# EAGLE design KonamiSCC_Replacement (EAGLE 7.5.0)
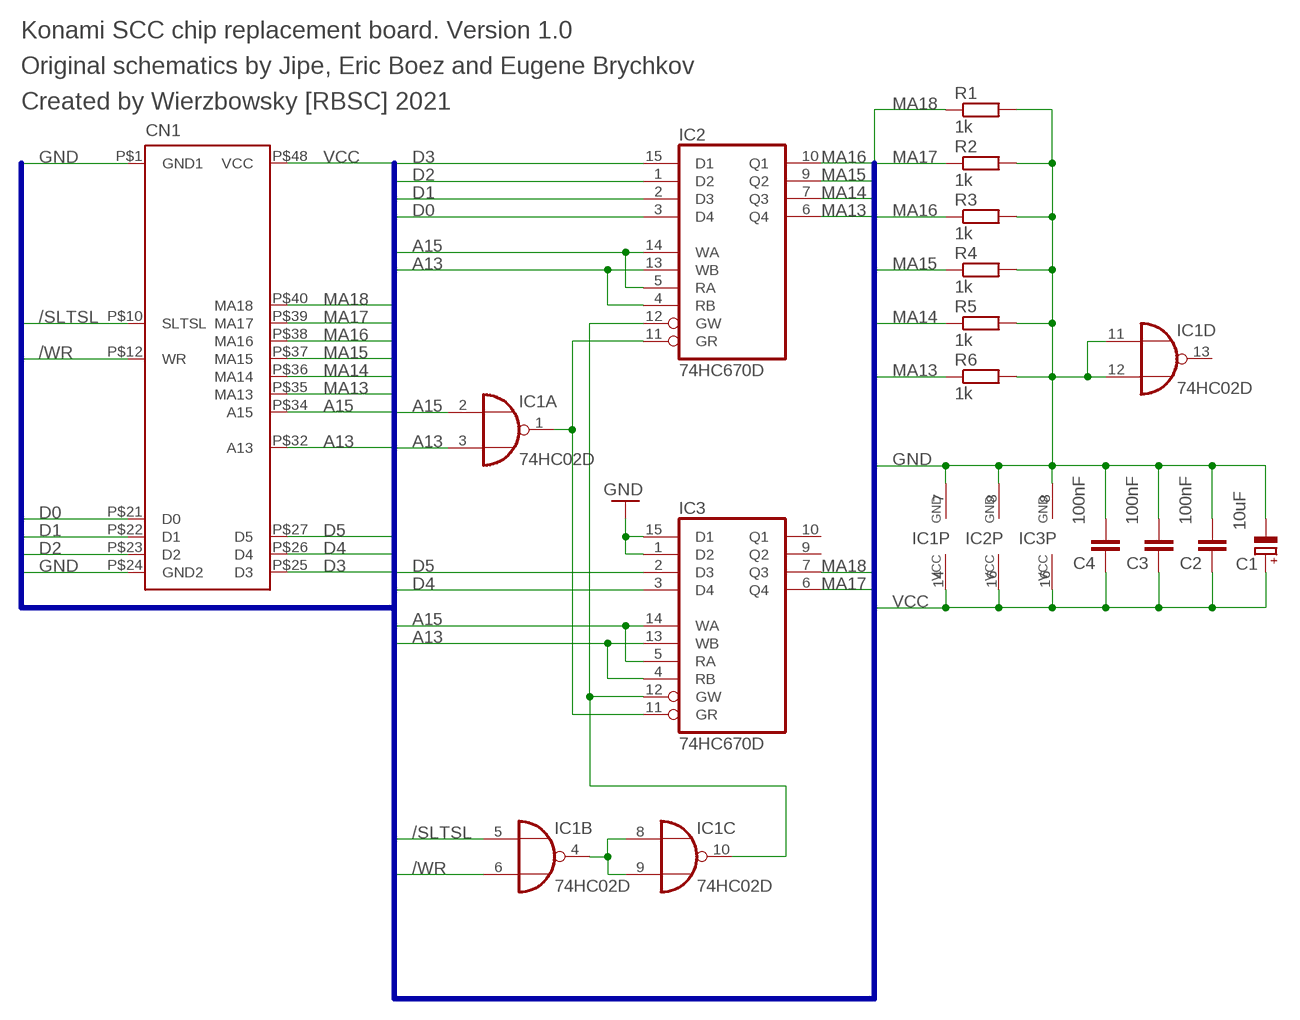
[diagram p0: schematic, sheet 1]

## Parts
C1  10uF  CPOL-EUSMCC  [SMC_C]
C2  100nF  C-EUC0805  [C0805]
C3  100nF  C-EUC0805  [C0805]
C4  100nF  C-EUC0805  [C0805]
CN1  2212P003_PLACEHOLDERP  [DIP48]
IC1  74HC02D  [SO14]
IC2  74HC670D  [SO16]
IC3  74HC670D  [SO16]
R1  1k  R-EU_M0805  [M0805]
R2  1k  R-EU_M0805  [M0805]
R3  1k  R-EU_M0805  [M0805]
R4  1k  R-EU_M0805  [M0805]
R5  1k  R-EU_M0805  [M0805]
R6  1k  R-EU_M0805  [M0805]

## Nets
/SLTSL: CN1.P$10(SLTSL) IC1.5(B:I0)
/WR: CN1.P$12(WR) IC1.6(B:I1)
A13: CN1.P$32(A13) IC1.3(A:I1) IC2.4(RB) IC2.13(WB) IC3.4(RB) IC3.13(WB)
A15: CN1.P$34(A15) IC1.2(A:I0) IC2.5(RA) IC2.14(WA) IC3.5(RA) IC3.14(WA)
D0: CN1.P$21(D0) IC2.3(D4)
D1: CN1.P$22(D1) IC2.2(D3)
D2: CN1.P$23(D2) IC2.1(D2)
D3: CN1.P$25(D3) IC2.15(D1)
D4: CN1.P$26(D4) IC3.3(D4)
D5: CN1.P$27(D5) IC3.2(D3)
GND: C1.- C2.2 C3.2 C4.2 CN1.P$1(GND1) CN1.P$24(GND2) IC1.7(P:GND) IC1.11(D:I0) IC1.12(D:I1) IC2.8(GND) IC3.1(D2) IC3.8(GND) IC3.15(D1) R1.2 R2.2 R3.2 R4.2 R5.2 R6.2
MA13: CN1.P$35(MA13) IC2.6(Q4) R6.1
MA14: CN1.P$36(MA14) IC2.7(Q3) R5.1
MA15: CN1.P$37(MA15) IC2.9(Q2) R4.1
MA16: CN1.P$38(MA16) IC2.10(Q1) R3.1
MA17: CN1.P$39(MA17) IC3.6(Q4) R2.1
MA18: CN1.P$40(MA18) IC3.7(Q3) R1.1
N$1: IC1.4(B:O) IC1.8(C:I0) IC1.9(C:I1)
N$3: IC1.10(C:O) IC2.12(GW) IC3.12(GW)
N$4: IC1.1(A:O) IC2.11(GR) IC3.11(GR)
VCC: C1.+ C2.1 C3.1 C4.1 CN1.P$48(VCC) IC1.14(P:VCC) IC2.16(VCC) IC3.16(VCC)
Unconnected: IC1.13(D:O) IC3.9(Q2) IC3.10(Q1)

## Buses
VCC,GND,D7,D6,D5,D4,D3,D2,D1,D0,A15,A14,A13,A12,A11,A10,A9,A8,A7,A6,A5,A4,A3,A2,A1,A0,/WR,/RD,/SLTSL,MA13,MA14,MA15,MA16,MA17,MA18,/CE

## Notes on the sheet
- Konami SCC chip replacement board. Version 1.0
- Original schematics by Jipe, Eric Boez and Eugene Brychkov
- Created by Wierzbowsky [RBSC] 2021

## Library data of the parts
C1 = rcl:CPOL-EU: POLARIZED CAPACITOR, European symbol
C2-C4 = rcl:C-EU: CAPACITOR, European symbol
CN1 = 2212P003_Placeholder:2212P003_PLACEHOLDER: Konami SCC 2212P003 Placeholder
IC1 = 74xx-eu:74*02: Quad 2-input NOR gate
IC2 IC3 = 74xx-eu:74*670: 4 by 4 REGISTER FILES, 3-state
R1-R6 = rcl:R-EU_: RESISTOR, European symbol

## Board
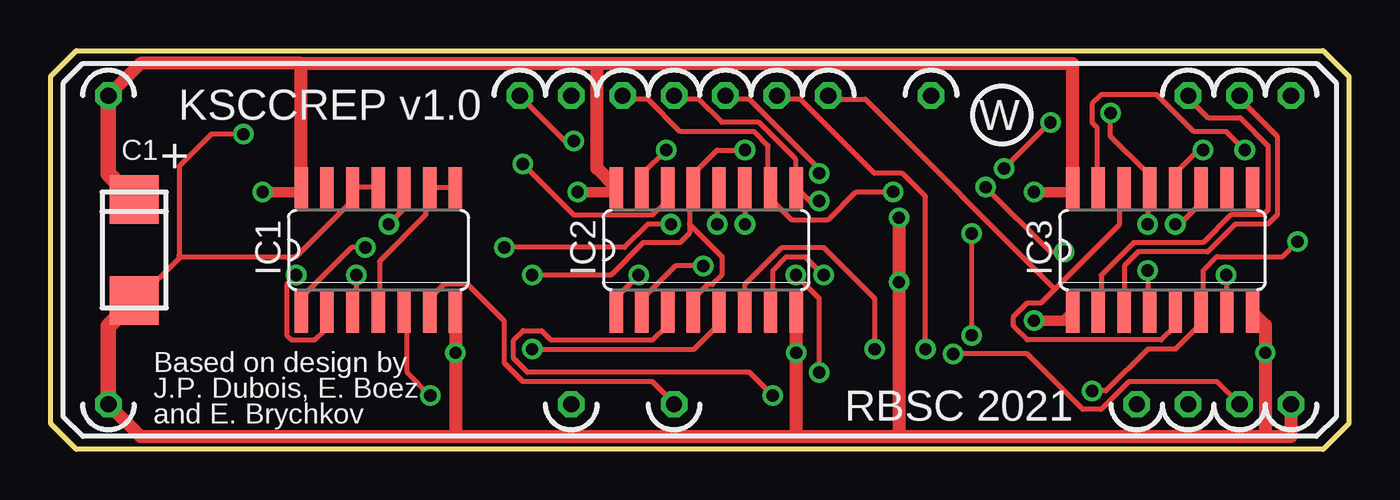
[diagram p1: board, top side]
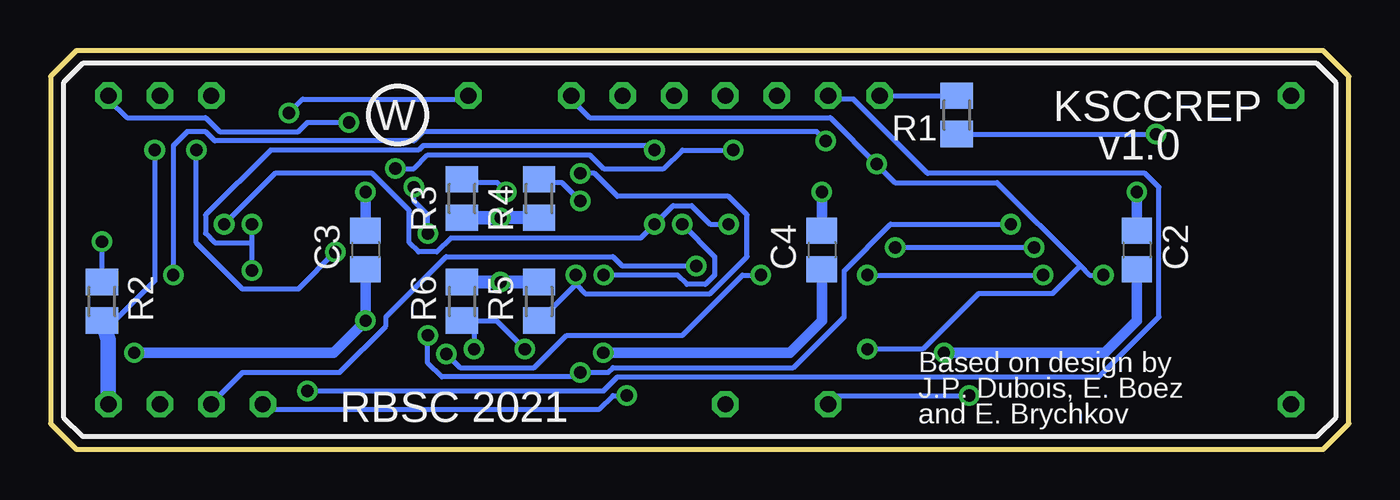
[diagram p2: board, bottom side, seen from below]

Size 64.13 x 19.69 mm. Coordinates in mm from the lower left corner, seen from the top.
Outline: 1.27,19.69 62.87,19.69 64.13,18.42 64.13,1.27 62.87,0 1.27,0 0,1.27 0,18.42 1.27,19.69
Copper layers (1*16): Top 0.035mm / dielectric 1.5mm / Bottom 0.035mm
Design rules "default *": minimum track width 10mil, minimum drill 24mil, track to track 8mil, track to pad 8mil, pad to pad 8mil, via to via 8mil, smd to smd 8mil, copper to edge 40mil, drill to drill 8mil, minimum pad ring 10mil, minimum via ring 8mil, stop-mask expansion 4mil, vias tented up to drill 100mil, thermal gap 10mil

### Footprints (pad centres in the part's own frame; a part is rotated, then mirrored left to right if it is on the bottom)
SMC_C = smd 2.4 x 2.4: + -2.5,0; - 2.5,0
C0805 = smd 1.3 x 1.5: 1 -0.95,0; 2 0.95,0
DIP48 = drill 0.8 octagon: P$1 0,0; P$10 22.86,0; P$12 27.94,0; P$21 50.8,0; P$22 53.34,0; P$23 55.88,0; P$24 58.42,0; P$25 58.42,15.24; P$26 55.88,15.24; P$27 53.34,15.24; P$32 40.64,15.24; P$34 35.56,15.24; P$35 33.02,15.24; P$36 30.48,15.24; P$37 27.94,15.24; P$38 25.4,15.24; P$39 22.86,15.24; P$40 20.32,15.24; P$48 0,15.24
SO14 = smd 0.66 x 2.032: 1 -3.81,-3.073; 2 -2.54,-3.073; 3 -1.27,-3.073; 4 0,-3.073; 5 1.27,-3.073; 6 2.54,-3.073; 7 3.81,-3.073; 8 3.81,3.073; 9 2.54,3.073; 10 1.27,3.073; 11 0,3.073; 12 -1.27,3.073; 13 -2.54,3.073; 14 -3.81,3.073
SO16 = smd 0.66 x 2.032: 1 -4.445,-3.073; 2 -3.175,-3.073; 3 -1.905,-3.073; 4 -0.635,-3.073; 5 0.635,-3.073; 6 1.905,-3.073; 7 3.175,-3.073; 8 4.445,-3.073; 9 4.445,3.073; 10 3.175,3.073; 11 1.905,3.073; 12 0.635,3.073; 13 -0.635,3.073; 14 -1.905,3.073; 15 -3.175,3.073; 16 -4.445,3.073
M0805 = smd 1.3 x 1.6: 1 -0.95,0; 2 0.95,0

### Placement (x,y rotation side)
C1  4.13,9.84 270 top
C2  10.48,9.84 270 bottom
C3  48.58,9.84 270 bottom
C4  26.04,9.84 270 bottom
CN1  2.86,2.22 0 top
IC1  16.19,9.84 0 top
IC2  32.38,9.84 0 top
IC3  54.93,9.84 0 top
R1  19.37,16.51 270 bottom
R2  61.59,7.3 270 bottom
R3  43.82,12.38 270 bottom
R4  40.01,12.38 270 bottom
R5  40.01,7.3 90 bottom
R6  43.82,7.3 90 bottom

### Tracks (layer width: path | path; a pad name or v marks a point on that pad's centre or on a via)
/SLTSL  (via drill 0.61)
  Top 0.254: v18.76,2.65 17.61,3.8 17.61,6.77 IC1.5
  Bottom 0.254: v18.76,2.65 25.39,2.65 25.62,2.43 CN1.P$10
/WR
  Top 0.254: IC1.6 18.76,6.77 18.76,7.45 19.44,8.14 20.59,8.14 22.42,6.31 22.42,4.25 23.33,3.34 29.73,3.34 30.65,2.43 CN1.P$12
A13  (via drill 0.61)
  Top 0.254: v54.19,8.83 54.19,6.77 IC3.4 | v54.19,11.11 54.19,12.71 IC3.13 54.19,12.94 54.19,13.63 52.36,15.46 v52.36,16.6 | v15.1,8.6 15.1,6.77 IC1.3 | v23.79,8.6 27.67,8.6 29.27,10.2 31.1,10.2 31.56,10.66 31.56,11.11 | 31.56,11.11 31.56,12.71 IC2.13 31.79,12.94 31.79,13.63 32.93,14.77 v34.3,14.77 | 31.56,11.11 33.16,9.51 33.16,8.6 32.7,8.14 32.47,8.14 31.79,7.45 31.79,6.77 IC2.4
  Bottom 0.254: v54.19,11.11 54.19,10.2 | 54.19,10.2 v54.19,8.83 | v52.36,16.6 51.68,17.28 43.68,17.28 CN1.P$32 | v23.79,8.6 v15.1,8.6 | 54.19,10.2 56.02,10.2 56.48,10.66 56.48,11.57 53.28,14.77 45.96,14.77 45.73,15 34.53,15 v34.3,14.77
A15  (via drill 0.61)
  Top 0.254: 49.62,7.91 48.93,7.23 48.25,7.23 47.56,6.54 47.56,6.08 48.25,5.4 54.88,5.4 55.56,6.08 IC3.5 | 49.62,7.91 52.82,11.11 52.82,12.71 IC3.14 | v12.13,8.6 11.67,8.14 11.67,5.63 11.9,5.4 13.04,5.4 13.5,5.85 13.5,6.77 IC1.2 | v23.79,4.94 31.79,4.94 32.93,6.08 32.93,6.77 IC2.5 | v23.33,14.08 25.84,11.57 29.73,11.57 30.42,12.26 30.42,12.71 IC2.14 | 49.62,7.91 40.25,17.28 38.42,17.28 CN1.P$34
  Bottom 0.254: v12.13,8.6 12.81,8.6 13.27,9.06 | 13.27,9.06 17.39,13.17 22.42,13.17 v23.33,14.08 25.62,16.37 37.5,16.37 38.42,17.28 CN1.P$34 | v23.79,4.94 21.04,4.94 18.3,7.68 14.64,7.68 13.27,9.06
D0  (via drill 0.61)
  Top 0.254: v35.67,2.65 34.53,3.8 23.56,3.8 22.87,4.48 22.87,5.4 23.33,5.85 24.24,5.85 24.7,5.4 29.73,5.4 30.42,6.08 30.42,6.77 IC2.3
  Bottom 0.254: v35.67,2.65 36.36,2.65 37.05,1.97 53.28,1.97 53.51,2.2 CN1.P$21
D1  (via drill 0.61)
  Top 0.254: v32.25,9.06 30.87,9.06 29.27,7.45 29.27,6.77 IC2.2
  Bottom 0.254: v32.25,9.06 35.9,9.06 36.36,9.51 44.59,9.51 47.56,6.54 47.56,6.08 49.85,3.8 54.65,3.8 56.02,2.43 CN1.P$22
D2  (via drill 0.61)
  Top 0.254: v29.04,8.6 28.13,7.68 28.13,6.77 IC2.1 | v44.59,4.71 48.25,4.71 50.99,1.97 51.9,1.97 53.28,3.34 57.62,3.34 CN1.P$23
  Bottom 0.254: v29.04,8.6 29.96,8.6 32.93,5.63 38.65,5.63 40.25,4.03 43.9,4.03 v44.59,4.71
D3  (via drill 0.61)
  Top 0.254: v30.42,14.77 29.27,13.63 29.27,12.94 IC2.15 | v49.39,16.14 v47.1,13.86
  Bottom 0.254: v30.42,14.77 32.93,14.77 33.85,13.86 36.82,13.86 37.5,14.54 45.5,14.54 46.19,13.86 v47.1,13.86 | v49.39,16.14 51.45,16.14 51.9,15.68 55.79,15.68 56.48,16.37 60.36,16.37 61.28,17.28 CN1.P$25
D4
  Top 0.254: IC3.3 53.05,6.77 53.05,9.06 53.73,9.74 57.16,9.74 58.53,11.11 60.13,11.11 60.59,11.57 60.59,15.46 58.76,17.28 CN1.P$26
D5
  Top 0.254: IC3.2 51.9,6.77 51.9,8.6 53.51,10.2 56.93,10.2 58.31,11.57 59.91,11.57 60.13,11.8 60.13,15 58.76,16.37 57.16,16.37 56.25,17.28 CN1.P$27
GND  (via drill 0.6, 0.61)
  Top 0.254: IC1.11 16.01,12.94 15.1,12.94 IC1.12 14.87,12.71 14.87,12.26 12.13,9.51 6.41,9.51 | v58.99,14.77 58.08,15.68 56.48,15.68 54.65,17.51 51.9,17.51 51.45,17.06 51.45,16.14 51.68,15.91 51.68,12.94 IC3.15 | 6.41,9.51 4.36,7.45 C1.- | v9.53,15.56 7.94,15.56 6.35,13.97 6.35,9.58 6.41,9.51
  Top 0.508: 50.38,6.67 IC3.1 50.06,6.35 v48.58,6.35
  Top 0.635: 20,0.64 4.44,0.64 CN1.P$1 | 20,0.64 36.83,0.64 | 36.83,0.64 41.91,0.64 | 41.91,0.64 60.01,0.64 | 60.01,0.64 61.28,0.64 CN1.P$24 | IC1.7 v20,4.76 20,0.64 | IC2.8 v36.83,4.76 36.83,0.64 | IC3.8 60.01,6.13 v60.01,4.76 60.01,0.64 | v41.91,11.43 v41.91,8.25 41.91,0.64
  Top 0.762: CN1.P$1 2.86,6.07 C1.-
  Bottom 0.254: 42.08,8.25 42.08,8.37 v41.91,8.25 | v58.99,14.77 58.99,8.32 60.96,6.35 R2.2 | R1.2 v9.53,15.56
  Bottom 0.508: C3.2 v48.58,6.35 50.16,4.76 v60.01,4.76 | C4.2 26.03,6.35 27.62,4.76 v36.83,4.76 | C2.2 10.48,6.35 12.06,4.76 v20,4.76
  Bottom 0.635: R5.2 42.08,8.25 R6.2 | R4.2 R3.2 v41.91,11.43
  Bottom 0.762: R2.2 61.28,5.4 CN1.P$24 | v41.91,11.43
MA13  (via drill 0.61)
  Top 0.254: v40.7,4.94 40.7,7.45 38.19,9.97 36.13,9.97 34.3,8.14 IC2.6 | v43.22,4.94 43.22,12.48 42.08,13.63 40.7,13.63 37.05,17.28 35.9,17.28 CN1.P$35
  Bottom 0.254: 43.22,6.31 42.08,6.31 v40.7,4.94 | 43.22,6.31 43.68,6.31 R6.1 43.22,6.31 | 43.22,6.31 v43.22,4.94
MA14  (via drill 0.61)
  Top 0.254: v38.19,8.6 37.27,9.51 36.36,9.51 35.67,8.83 35.67,6.77 IC2.7 | v37.96,13.63 37.96,13.86 34.53,17.28 33.39,17.28 CN1.P$36
  Bottom 0.254: 38.19,8.14 39.79,6.54 R5.1 | v37.96,13.63 37.27,13.63 36.13,12.48 30.65,12.48 29.73,11.57 29.73,9.51 31.56,7.68 37.73,7.68 38.19,8.14 | 38.19,8.14 v38.19,8.6
MA15  (via drill 0.61)
  Top 0.254: v37.96,12.26 37.5,12.26 37.05,12.71 IC2.9 36.82,12.94 36.82,14.31 34.99,16.14 33.16,16.14 32.02,17.28 30.87,17.28 CN1.P$37
  Bottom 0.254: v37.96,12.26 38.87,13.17 39.79,13.17 R4.1
MA16  (via drill 0.61)
  Top 0.254: v41.62,12.71 39.79,12.71 38.42,11.34 36.59,11.34 35.67,12.26 35.67,12.71 IC2.10 35.45,12.94 35.45,15 34.76,15.68 31.1,15.68 29.5,17.28 28.36,17.28 CN1.P$38
  Bottom 0.254: v41.62,12.71 42.08,13.17 43.68,13.17 R3.1
MA17  (via drill 0.61)
  Top 0.254: v51.45,2.88 52.13,2.88 54.19,4.94 55.56,4.94 56.71,6.08 56.71,6.77 IC3.6 56.93,6.77 56.93,8.83 57.62,9.51 60.86,9.51 v61.59,10.25
  Bottom 0.254: v51.45,2.88 36.82,2.88 36.13,3.57 12.36,3.57 9.39,6.54 9.39,12.94 10.07,13.63 20.82,13.63 24.47,17.28 25.62,17.28 CN1.P$39 | R2.1 v61.59,10.25
MA18  (via drill 0.61)
  Top 0.254: v58.08,8.6 58.08,6.77 IC3.7 | v25.84,15.23 25.39,15.23 23.33,17.28 CN1.P$40
  Bottom 0.254: v58.08,8.6 58.08,15 57.39,15.68 56.48,15.68 56.02,15.23 46.19,15.23 45.73,15.68 26.3,15.68 v25.84,15.23 | CN1.P$40 R1.1
N$1
  Top 0.254: IC1.4 16.24,6.77 16.24,9.28 18.53,11.57 18.53,12.71 IC1.9 18.76,12.94 19.9,12.94 IC1.8
N$3  (via drill 0.61)
  Top 0.254: v16.7,11.11 17.39,11.8 17.39,12.71 IC1.10 | v37.96,3.8 37.96,7.45 v36.82,8.6 | v32.93,11.11 32.93,12.71 IC2.12 | IC3.12 55.56,13.63 56.71,14.77 v56.93,14.77 | v50.08,9.74 49.39,9.74 v46.19,12.94 | v45.5,5.63 v45.5,10.66
  Bottom 0.254: v16.7,11.11 22.64,11.11 24.93,8.83 24.93,6.54 27.44,4.03 36.36,4.03 36.59,3.8 v37.96,3.8 38.19,3.57 44.82,3.57 45.5,4.25 v45.5,5.63 | v36.82,8.6 33.16,8.6 32.7,8.14 31.79,8.14 31.33,8.6 31.33,9.51 v32.93,11.11 | v56.93,14.77 56.93,10.2 54.65,7.91 51.9,7.91 v50.08,9.74 | v46.19,12.94 46.19,12.26 45.5,11.57 v45.5,10.66
N$4  (via drill 0.61)
  Top 0.254: v15.56,9.97 14.87,9.97 12.59,7.68 12.59,6.77 IC1.1 | v22.42,9.97 28.36,9.97 29.5,11.11 v30.65,11.11 | v34.3,11.11 34.3,12.71 IC2.11 | v55.56,11.11 55.79,11.11 56.71,12.03 56.71,12.71 IC3.11
  Bottom 0.254: v22.42,9.97 v15.56,9.97 | v30.65,11.11 31.56,11.11 32.47,12.03 33.39,12.03 v34.3,11.11 34.99,10.43 44.36,10.43 45.05,9.74 45.96,9.74 46.42,10.2 46.42,11.8 48.25,13.63 53.05,13.63 v55.56,11.11
VCC  (via drill 0.6)
  Top 0.508: v10.48,12.7 12.17,12.7 IC1.14 | v26.03,12.7 27.72,12.7 IC2.16 | v48.58,12.7 50.27,12.7 IC3.16
  Top 0.635: 12.38,19.05 26.99,19.05 | 26.99,19.05 50.48,19.05 IC3.16 | IC2.16 26.99,13.87 26.99,19.05 | IC1.14 12.38,19.05 | 12.38,19.05 4.44,19.05 CN1.P$48
  Top 0.762: C1.+ 2.86,13.61 CN1.P$48
  Bottom 0.508: C2.1 v10.48,12.7 | C4.1 v26.03,12.7 | C3.1 v48.58,12.7

### Text on the board
tNames: KSCCREP v1.0 | W | + | Based on design by | J.P. Dubois, E. Boez | RBSC 2021 | and E. Brychkov
bNames: W | KSCCREP | v1.0 | Based on design by | J.P. Dubois, E. Boez | and E. Brychkov | RBSC 2021